# Altium schematic sheet Main.SchDoc
size 508 x 254 mm; SheetNumber: 1
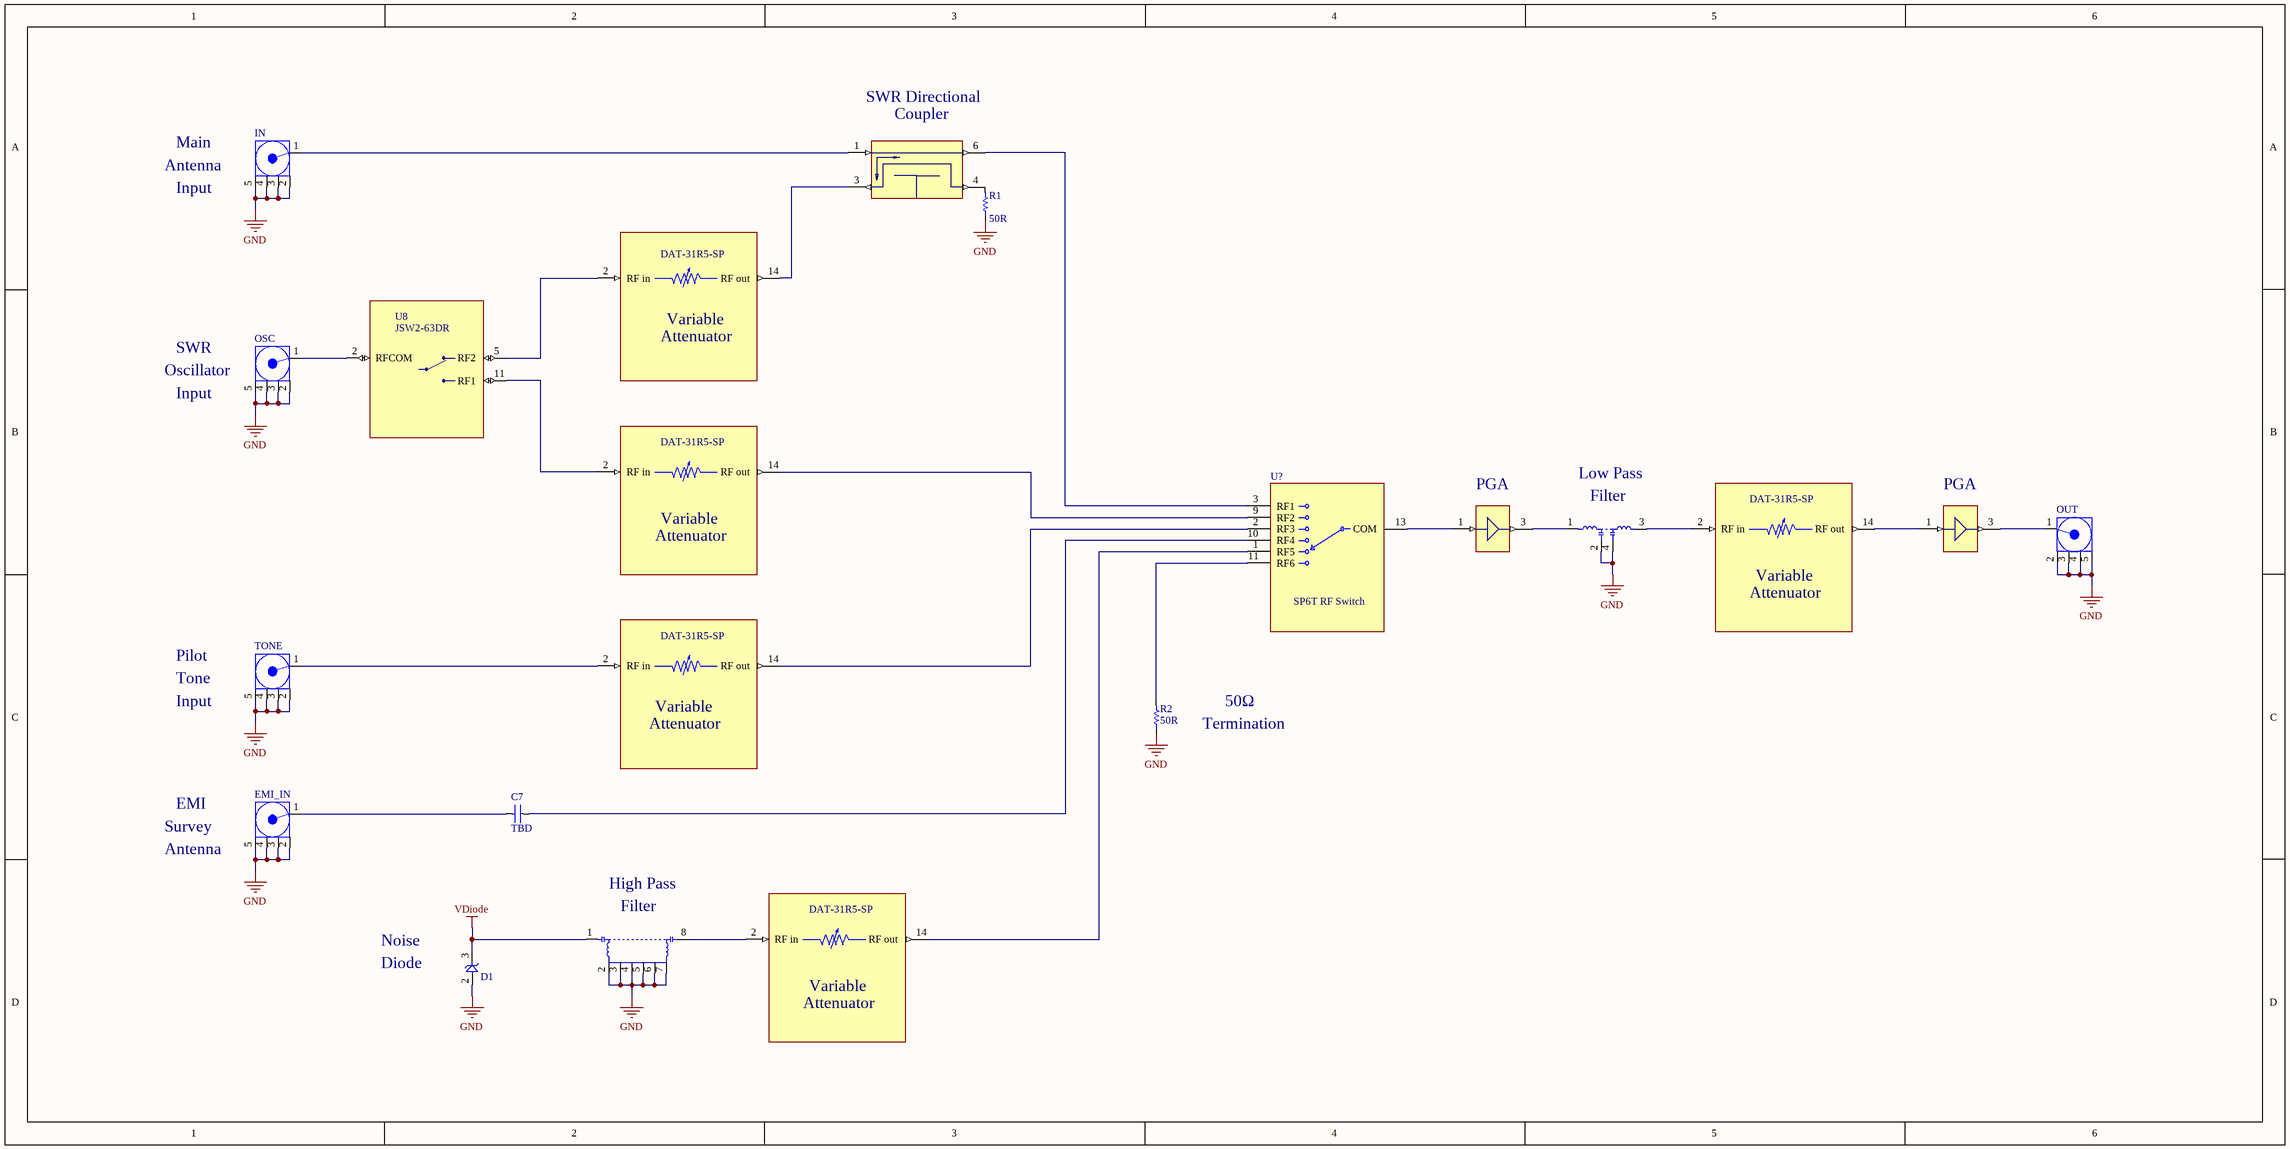
[diagram p0: Main.SchDoc]

## Parts
(Parts that share a designator on the sheet are numbered #1, #2 ... from top to bottom, then left to right.)
C7  value TBD  [0402C]  (hidden comment: Cap)
D1  NC303SOT  [SOT323-3AN]  (value not drawn)
EMI_IN  COAX-M  [SMT RA SMA Connector]  (value not drawn)
IN  COAX-M  [SMT RA SMA Connector]  (value not drawn)
LC20  LFCN-400  [FV1206]  (value not drawn)
LC21  SXHP-48  [HF1139]  (value not drawn)
OSC  COAX-M  [SMT RA SMA Connector]  (value not drawn)
OUT  COAX-M  [SMT RA SMA Connector]  (value not drawn)
R1  value 50R  [0603R]  (hidden comment: FC0603-50BFCT-ND)
R2  value 50R  [0603R]  (hidden comment: FC0603-50BFCT-ND)
TONE  COAX-M  [SMT RA SMA Connector]  (value not drawn)
U1  ADC-10-4  [CD542]  (value not drawn)
U3  PGA-103+  [DF782]  (value not drawn)
U4  PGA-103+  [DF782]  (value not drawn)
U8  JSW2-63DR  [MT1818]
U?#1  DAT-31R5-SP  [QFN50P400X400X90_HS-21N]
U?#2  DAT-31R5-SP  [QFN50P400X400X90_HS-21N]
U?#3  DAT-31R5-SP  [QFN50P400X400X90_HS-21N]
U?#4  SP6T RF Switch  [MT1817]
U?#5  DAT-31R5-SP  [QFN50P400X400X90_HS-21N]
U?#6  DAT-31R5-SP  [QFN50P400X400X90_HS-21N]

## Nets
GND: D1.2(A) EMI_IN.2(GND) EMI_IN.3(GND) EMI_IN.4(GND) EMI_IN.5(GND) IN.2(GND) IN.3(GND) IN.4(GND) IN.5(GND) LC20.2 LC20.4 LC21.2 LC21.3 LC21.4 LC21.5 LC21.6 LC21.7 OSC.2(GND) OSC.3(GND) OSC.4(GND) OSC.5(GND) OUT.2(GND) OUT.3(GND) OUT.4(GND) OUT.5(GND) R1.1 R2.1 TONE.2(GND) TONE.3(GND) TONE.4(GND) TONE.5(GND)
VDiode: D1.3(C) LC21.1
NetC7_1: C7.1 EMI_IN.1(Signal)
NetC7_2: C7.2 U?#4.10(RF4)
NetIN_1: IN.1(Signal) U1.1(Input)
NetLC20_1: LC20.1 U3.3(Gnd)
NetLC20_3: LC20.3 U?#3.2(RF_in)
NetLC21_8: LC21.8 U?#6.2(RF_in)
NetOSC_1: OSC.1(Signal) U8.2(RFCOM)
NetOUT_1: OUT.1(Signal) U4.3(Gnd)
NetR1_2: R1.2 U1.4(Termination)
NetR2_2: R2.2 U?#4.11(RF6)
NetTONE_1: TONE.1(Signal) U?#5.2(RF_in)
NetU1_3: U1.3(Coupled) U?#1.14(RF_out)
NetU1_6: U1.6(Output) U?#4.3(RF1)
NetU3_1: U3.1(In) U?#4.13(COM)
NetU4_1: U4.1(In) U?#3.14(RF_out)
NetU8_5: U8.5(RF2) U?#1.2(RF_in)
NetU8_11: U8.11(RF1) U?#2.2(RF_in)
NetU?#2_14: U?#2.14(RF_out) U?#4.9(RF2)
NetU?#4_1: U?#4.1(RF5) U?#6.14(RF_out)
NetU?#4_2: U?#4.2(RF3) U?#5.14(RF_out)

Not connected (* = marked no-connect by the designer): U1 5(DNC); U?#1 1(C16) 3(Data) 4(Clock) 5(LE) 6(VDD) 7(N/C) 8(N/C) 9(VDD) 10(GND) 11(GND) 12(GND) 13(VDD) 15(C8) 16(C4) 17(C2) 18(GND) 19(C1) 20(C0.5) 21(GND); U?#2 1(C16) 3(Data) 4(Clock) 5(LE) 6(VDD) 7(N/C) 8(N/C) 9(VDD) 10(GND) 11(GND) 12(GND) 13(VDD) 15(C8) 16(C4) 17(C2) 18(GND) 19(C1) 20(C0.5) 21(GND); U?#3 1(C16) 3(Data) 4(Clock) 5(LE) 6(VDD) 7(N/C) 8(N/C) 9(VDD) 10(GND) 11(GND) 12(GND) 13(VDD) 15(C8) 16(C4) 17(C2) 18(GND) 19(C1) 20(C0.5) 21(GND); U?#5 1(C16) 3(Data) 4(Clock) 5(LE) 6(VDD) 7(N/C) 8(N/C) 9(VDD) 10(GND) 11(GND) 12(GND) 13(VDD) 15(C8) 16(C4) 17(C2) 18(GND) 19(C1) 20(C0.5) 21(GND); U?#6 1(C16) 3(Data) 4(Clock) 5(LE) 6(VDD) 7(N/C) 8(N/C) 9(VDD) 10(GND) 11(GND) 12(GND) 13(VDD) 15(C8) 16(C4) 17(C2) 18(GND) 19(C1) 20(C0.5) 21(GND)

## Notes on the sheet
- SWR Directional
- (near U1) Coupler
- (near IN) Antenna
- Main
- (near IN) Input
- SWR
- Attenuator
- (near U?#1) Variable
- (near OSC) Oscillator
- (near OSC) Input
- Low Pass
- (near U?#2) Variable
- (near U3) PGA
- (near LC20) Filter
- (near U4) PGA
- (near U?#3) Variable
- Tone
- (near TONE) Pilot
- (near TONE) Input
- (near U?#5) Variable
- 50Ω
- Termination
- EMI
- (near EMI_IN) Survey
- (near EMI_IN) Antenna
- High Pass
- (near LC21) Filter
- Diode
- Noise
- (near U?#6) Variable
- Title
- Size:
- Date:
- Tabloid
- Number:
- Time:
- Revision:
- Sheet
- of
- File:

## Library data of the parts
C7 = Cap: Capacitor; Published: 8-Jun-2000; LatestRevisionDate: 17-Jul-2002; LatestRevisionNote: Re-released for DXP Platform.; PackageReference: RAD-0.3; Publisher: Altium Limited
D1 = NC303SOT: SMT Noise Diode
EMI_IN IN OSC OUT TONE = COAX-M: RF Coaxial PCB Connector, MMCX; Thru-Hole, Vertical Mount Plug,  50 Ohm Impedance; PackageDocument: Rev. A, 16-Jun-1997; PCB_Layout: Complies with manufacturer's recommendation.; DrillSize: Corresponds to nominal value.; Published: 15-Jul-2004; LatestRevisionDate: 15-Jul-2004; LatestRevisionNote: Component Replaced.; DatasheetDocument: 30-May-2003; PackageReference: 908-21103; Publisher: Altium Limited; ComponentLink1Description: Manufacturer Link; ComponentLink1URL: http://www.amphenolrf.com/
LC20 = LFCN-xxx Filter: Ceramic Low Pass Filter
LC21 = SXHP-xx Filter: Integrated High Pass Filter
R1 R2 = RES Semi: Published: 8-Jun-2000; LatestRevisionDate: 17-Jul-2002; LatestRevisionNote: Re-released for DXP Platform.; PackageReference: AXIAL-0.5; Publisher: Altium Limited
U1 = ADC-10-4: Surface Mount Directional Coupler
U3 U4 = PGA-103+: Ultra Linear Low Noise Monolithic Amplifier
U8 = JSW2-63DR: SPDT RF Switch
U?#1-U?#3 U?#5 U?#6 = DAT-31R5-SP: 31.5 dB, 0.5 dB Step 6 Bit, Serial Control Interface, Single Positive Supply Voltage
U?#4 = JSW6-33DR+: SP6T RF Switch 50Ω 10 to 2700 MHz